# Altium schematic sheet Emulator.SchDoc
size A4
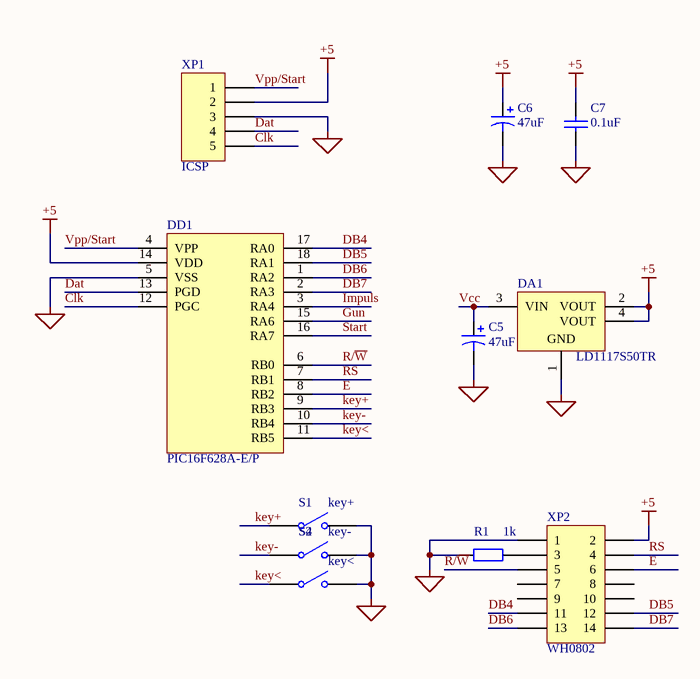
[diagram p0: Emulator.SchDoc]

## Parts
C5  value 47uF  [TC3528-1411]  (hidden comment: Cap Pol1)
C6  value 47uF  [TC3528-1411]  (hidden comment: Cap Pol1)
C7  value 0.1uF  [CAPC2012N]  (hidden comment: Cap)
DA1  LD1117S50TR  [SOT-223_N]
DD1  PIC16F628A-E/P  [SOIC127P1030-18N]
R1  value 1k  [RESC2012N]  (hidden comment: es2)
S1  key+  [SPST-2]
S2  key-  [SPST-2]
S4  key<  [SPST-2]
XP1  ICSP  [HDR1X5]
XP2  WH0802  [HDR2X7]

## Nets
+5: C6.1 C7.2 DA1.2(VOUT) DA1.4(VOUT) DD1.14(VDD) XP1.2 XP2.2
GND: C5.2 C6.2 C7.1 DA1.1(GND) DD1.5(VSS) R1.2 S1.2(NO) S2.2(NO) S4.2(NO) XP1.3 XP2.1
Clk: DD1.12(PGC) XP1.5
Dat: DD1.13(PGD) XP1.4
DB4: DD1.17(RA0) XP2.11
DB5: DD1.18(RA1) XP2.12
DB6: DD1.1(RA2) XP2.13
DB7: DD1.2(RA3) XP2.14
E: DD1.8(RB2) XP2.6
Gun: DD1.15(RA6)
Impuls: DD1.3(RA4)
key+: DD1.9(RB3) S1.1(COMMON)
key-: DD1.10(RB4) S2.1(COMMON)
key<: DD1.11(RB5) S4.1(COMMON)
R/~{W}: DD1.6(RB0) XP2.5
RS: DD1.7(RB1) XP2.4
Start: DD1.16(RA7)
Vcc: C5.1 DA1.3(VIN)
Vpp/Start: DD1.4(VPP) XP1.1
NetR1_1: R1.1 XP2.3

Not connected (* = marked no-connect by the designer): XP2 7 8 9 10

## Library data of the parts
C5 C6 = Cap Pol1: Polarized Capacitor (Radial); Published: 8-Jun-2000; LatestRevisionDate: 17-Jul-2002; LatestRevisionNote: Re-released for DXP Platform.; PackageReference: RB7.6-15; Publisher: Altium Limited; PackageDescription: Polarized Capacitor (Radial); 2 Leads
C7 = Cap: Capacitor; Published: 8-Jun-2000; LatestRevisionDate: 17-Jul-2002; LatestRevisionNote: Re-released for DXP Platform.; PackageReference: RAD-0.3; Publisher: Altium Limited; PackageDescription: Radial Cap, Thru-Hole; 2 Leads; 0.3 in Pin Spacing
DA1 = LD1117S50TR: Fixed Low Drop Positive Voltage Regulator, 5V, 4-Pin SOT-223, Tape and Reel; DatasheetVersion: Nov-2011; PackageVersion: 2010; PackageReference: SOT-223; PackageDescription: 4-Pin SOT-223 Package, 6.5 x 3.5 mm Body, 2.3 mm Pitch, 7 mm Lead Span; PartNumber: LD1117S50TR; ComponentLink1Description: Manufacturer URL; ComponentLink1URL: http://www.st.com; ComponentLink2Description: Datasheet; ComponentLink2URL: http://www.st.com/internet/com/TECHNICAL_RESOURCES/TECHNICAL_LITERATURE/DATASHEET/CD00000544.pdf
DD1 = PIC16F628A-E/P: FLASH-Based 8-Bit CMOS Microcontroller with nanoWatt Technology, 2K (x14-Bit words) FLASH, 224 Bytes SRAM, 18-Pin PDIP, 3.0 to 5.5V Supply Range, Extended Temperature; Published: 11-Oct-2004; LatestRevisionDate: 29-Jan-2009; LatestRevisionNote: Sch. layout revised. 3D Model Removed.; DatasheetVersion: revF, Mar-2007; PackageVersion: revBB, Aug-2009; PackageReference: PDIP300-P18; Publisher: Altium Limited; PackageDescription: 18-Lead Plastic Dual In-Line (P) - 300 mil Body [PDIP]; Supplier 1: Digi-Key; Supplier Part Number 1: PIC16F628A-E/P-ND; Code_JEDEC: MS-001; ComponentLink1Description: Datasheet; ComponentLink1URL: http://ww1.microchip.com/downloads/en/DeviceDoc/40044F.pdf; ComponentLink2Description: Packaging Specification; ComponentLink2URL: http://www.microchip.com/stellent/groups/techpub_sg/documents/packagingspec/en012702.pdf; ComponentLink3Description: Microchip.com Home; ComponentLink3URL: http://www.microchip.com/
R1 = Res2: Resistor; Published: 8-Jun-2000; LatestRevisionDate: 17-Jul-2002; LatestRevisionNote: Re-released for DXP Platform.; PackageReference: AXIAL-0.4; Publisher: Altium Limited; PackageDescription: Axial Device, Thru-Hole; 2 Leads; 0.4 in Pin Spacing
S1 S2 S4 = SW-SPST: Single-Pole, Single-Throw Switch; Published: 24-Mar-1999; LatestRevisionDate: 17-Jul-2002; LatestRevisionNote: Re-released for DXP Platform.; PackageReference: SPST-2; Publisher: Altium Limited; PackageDescription: Switch; 2 Leads
XP1 = Header 5: Header, 5-Pin; LatestRevisionDate: 17-Jul-2002; LatestRevisionNote: Re-released for DXP Platform.; Publisher: Altium Limited
XP2 = Header 7X2: Header, 7-Pin, Dual row; LatestRevisionDate: 17-Jul-2002; LatestRevisionNote: Re-released for DXP Platform.; Publisher: Altium Limited